# Altium project SAML21_Xplained_Pro.PrjPCB (part 1 of 3)
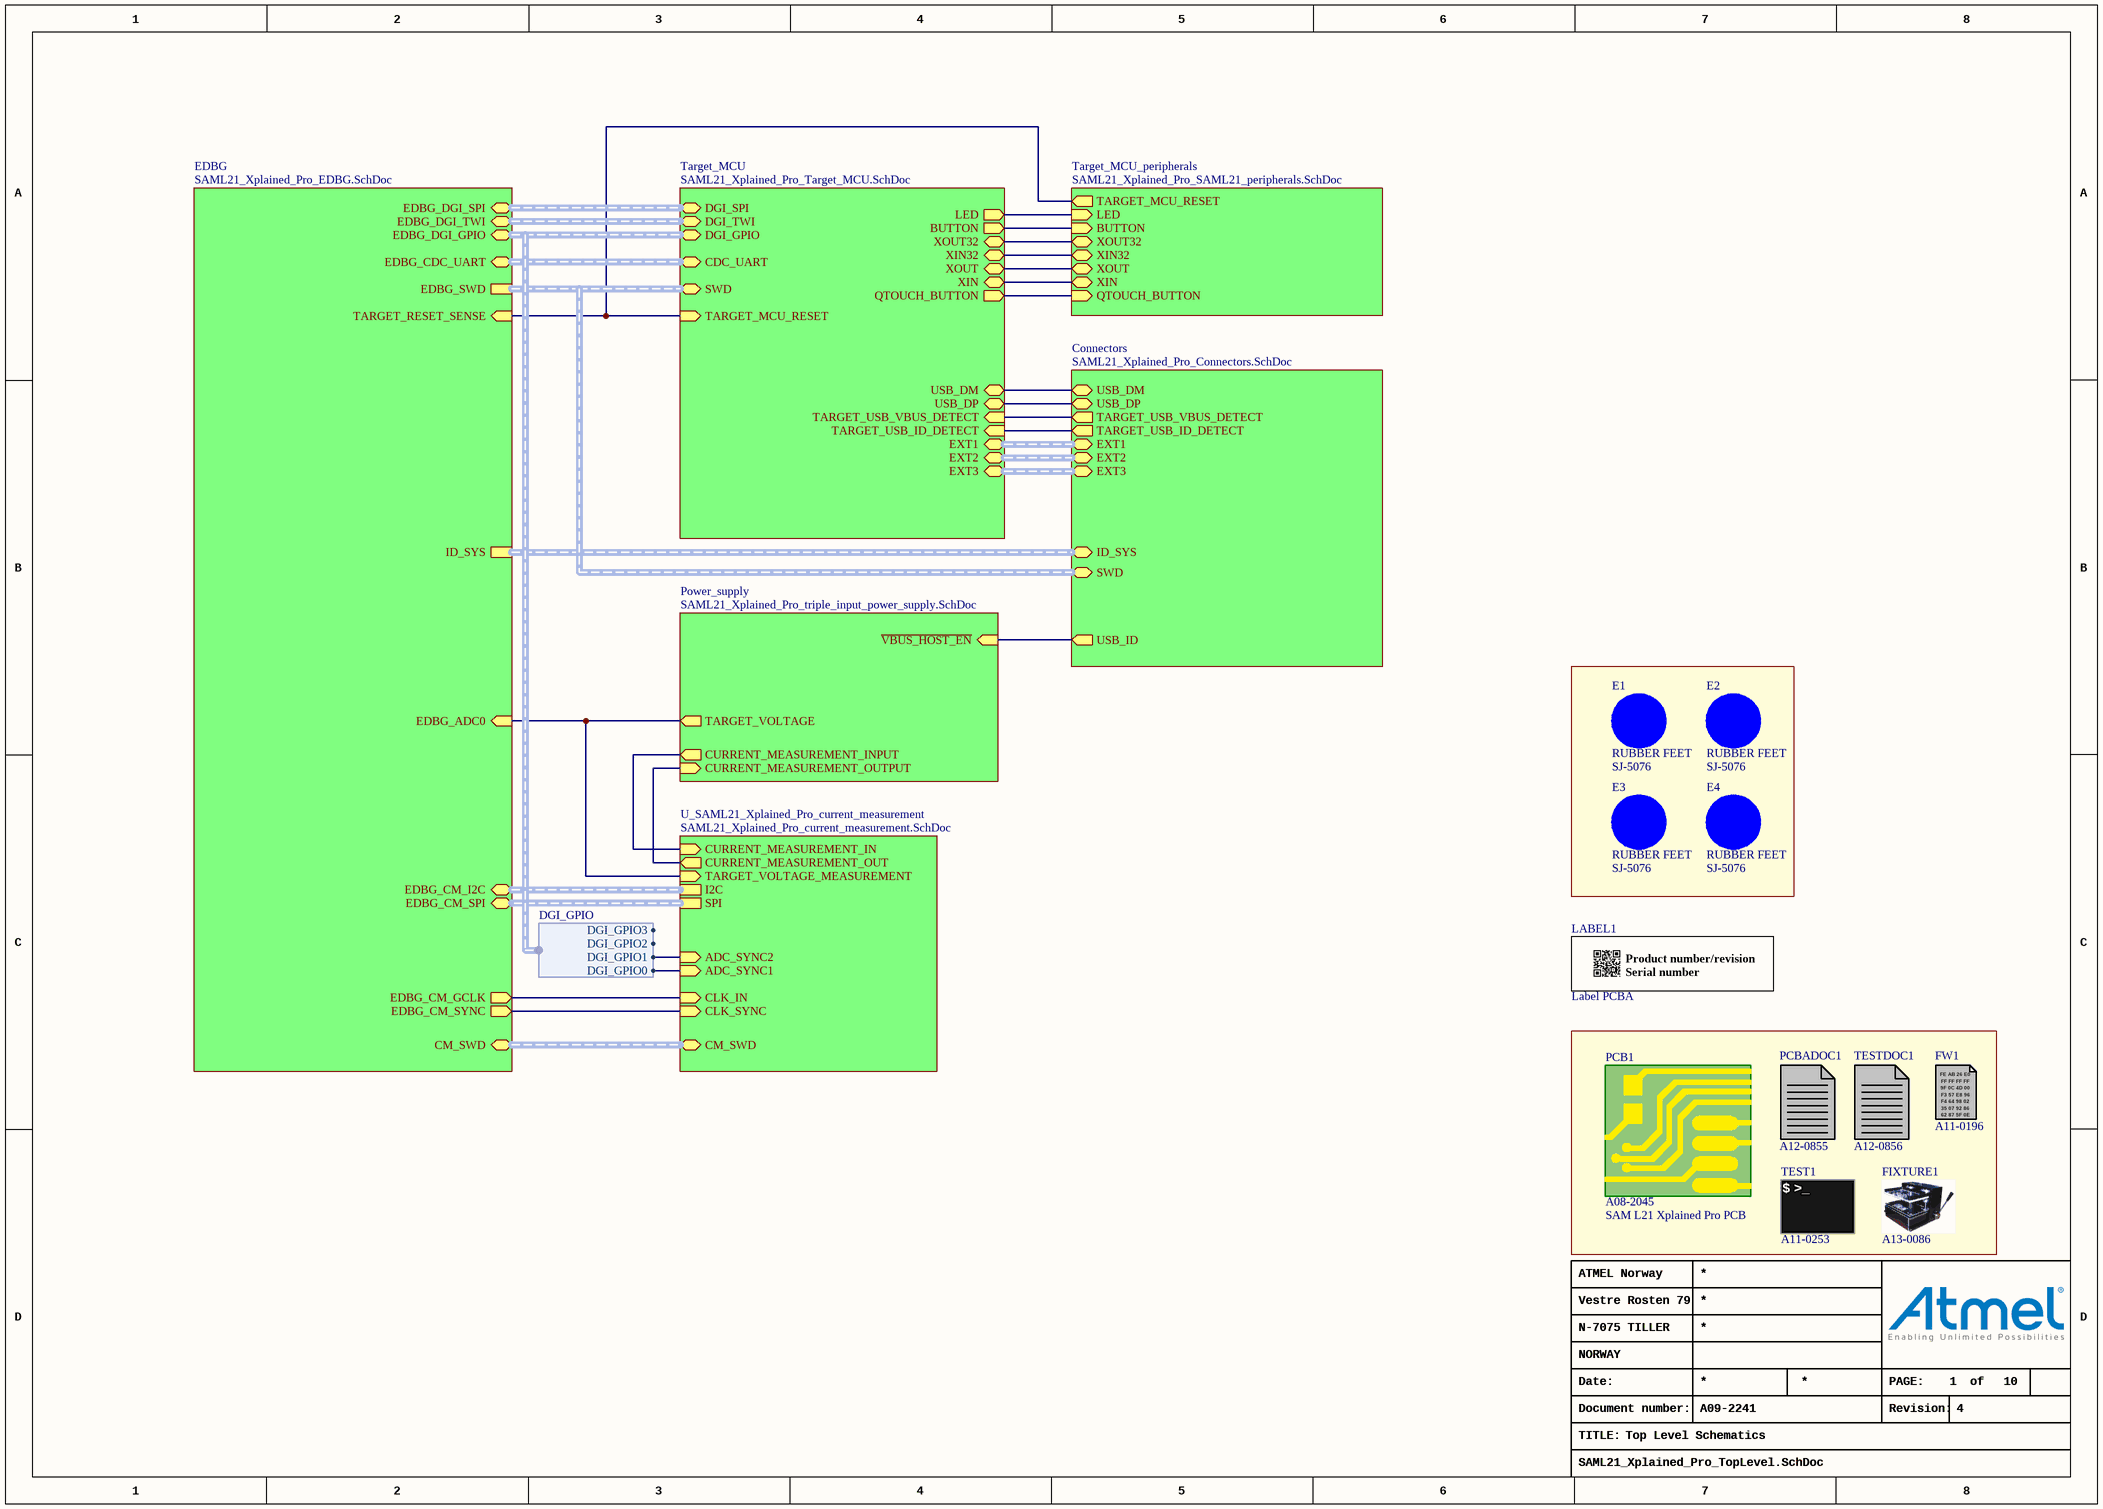
[diagram p0: SAML21_Xplained_Pro_TopLevel.SchDoc]
10 sheets, 207 parts. Net scope: hierarchical (ports join the sheet entries above them; power ports are global).
Board file: SAML21_Xplained_Pro.PcbDoc
Sheets:
  SAML21_Xplained_Pro_TopLevel.SchDoc
    Target_MCU = SAML21_Xplained_Pro_Target_MCU.SchDoc
    EDBG = SAML21_Xplained_Pro_EDBG.SchDoc
    Connectors = SAML21_Xplained_Pro_Connectors.SchDoc
    Power_supply = SAML21_Xplained_Pro_triple_input_power_supply.SchDoc
    U_SAML21_Xplained_Pro_current_measurement = SAML21_Xplained_Pro_current_measurement.SchDoc
      U_SAML21_Xplained_Pro_current_measurement_calibration = SAML21_Xplained_Pro_current_measurement_calibration.SchDoc
      U_SAML21_Xplained_Pro_current_measurement_control = SAML21_Xplained_Pro_current_measurement_control.SchDoc
      U_SAML21_Xplained_Pro_current_measurement_frontend = SAML21_Xplained_Pro_current_measurement_frontend.SchDoc
    Target_MCU_peripherals = SAML21_Xplained_Pro_SAML21_peripherals.SchDoc

## Sheet SAML21_Xplained_Pro_TopLevel.SchDoc: Top Level Schematics
size A3; Organization: ATMEL Norway; Address1: Vestre Rosten 79; Address2: N-7075 TILLER; Address3: NORWAY; DocumentNumber: A09-2241; Revision: 4; SheetNumber: 1; SheetTotal: 10; PageSetup: Record=PageOptions|CenterHorizontal=True|CenterVertical=True|PrintScale=1.01|XCorrection=1.00|YCorrection=1.00|PrintKind=1|BorderSize=5000000|LeftOffset=0|BottomOffset=0|Orientation=2|PaperLength=1000|PaperWidth=1000|Scale=100|PaperSource=7|PrintQuality=-4|MediaType=1|DitherType=10|PaperKind=Letter|PrintScaleMode=1

### Parts
E1  RUBBER FEET  value SJ-5076  [AP8-00192]
E2  RUBBER FEET  value SJ-5076  [AP8-00192]
E3  RUBBER FEET  value SJ-5076  [AP8-00192]
E4  RUBBER FEET  value SJ-5076  [AP8-00192]
FIXTURE1  AN: A13-0086  (hidden comment: JIG)  (mechanical)
FW1  AN: A11-0196  (hidden comment: FW)  (mechanical)
LABEL1  value Label PCBA  [AP8-00317]  (hidden comment: PCBA_LABEL)
PCB1  value SAM L21 Xplained Pro PCB  AN: A08-2045  (hidden comment: PCB)  (mechanical)
PCBADOC1  AN: A12-0855  (hidden comment: PCBADOC)  (mechanical)
TEST1  AN: A11-0253  (hidden comment: TEST)  (mechanical)
TESTDOC1  AN: A12-0856  (hidden comment: TESTDOC)  (mechanical)

### Sub-sheets
Connectors = SAML21_Xplained_Pro_Connectors.SchDoc: ID_SYS (harness ID_SYS), EXT1 (harness EXT), EXT3 (harness EXT), EXT2 (harness EXT), USB_ID (out), USB_DM (bidir), USB_DP (bidir), TARGET_USB_VBUS_DETECT (out), TARGET_USB_ID_DETECT (out), SWD (harness SWD)
EDBG = SAML21_Xplained_Pro_EDBG.SchDoc: ID_SYS (harness ID_SYS), EDBG_SWD (harness SWD), EDBG_CDC_UART (harness CDC_UART), EDBG_DGI_TWI (harness DGI_TWI), EDBG_DGI_SPI (harness DGI_SPI), EDBG_DGI_GPIO (harness DGI_GPIO), TARGET_RESET_SENSE (in), EDBG_ADC0 (in), EDBG_CM_I2C (harness I2C), EDBG_CM_SPI (harness SPI), EDBG_CM_GCLK (out), EDBG_CM_SYNC (out), CM_SWD (harness SWD)
Power_supply = SAML21_Xplained_Pro_triple_input_power_supply.SchDoc: TARGET_VOLTAGE (out), ~{VBUS_HOST_EN} (in), CURRENT_MEASUREMENT_INPUT (out), CURRENT_MEASUREMENT_OUTPUT (in)
Target_MCU = SAML21_Xplained_Pro_Target_MCU.SchDoc: SWD (harness SWD), DGI_SPI (harness DGI_SPI), DGI_TWI (harness DGI_TWI), DGI_GPIO (harness DGI_GPIO), CDC_UART (harness CDC_UART), TARGET_MCU_RESET (in), EXT2 (harness EXT), EXT3 (harness EXT), EXT1 (harness EXT), USB_DM (bidir), USB_DP (bidir), BUTTON (out), LED (out), TARGET_USB_VBUS_DETECT (in), TARGET_USB_ID_DETECT (in), XIN32 (bidir), XOUT32 (bidir), QTOUCH_BUTTON (out), XIN (bidir), XOUT (bidir)
Target_MCU_peripherals = SAML21_Xplained_Pro_SAML21_peripherals.SchDoc: XIN32 (bidir), XOUT32 (bidir), LED (in), QTOUCH_BUTTON (in), BUTTON (in), TARGET_MCU_RESET (out), XIN (bidir), XOUT (bidir)
U_SAML21_Xplained_Pro_current_measurement = SAML21_Xplained_Pro_current_measurement.SchDoc: I2C (harness I2C), SPI (harness SPI), ADC_SYNC1 (in), ADC_SYNC2 (in), CLK_IN (in), CLK_SYNC (in), CURRENT_MEASUREMENT_OUT (out), CURRENT_MEASUREMENT_IN (in), TARGET_VOLTAGE_MEASUREMENT (in), CM_SWD (harness SWD)

### Harnesses
DGI_GPIO: DGI_GPIO0, DGI_GPIO1, DGI_GPIO2, DGI_GPIO3

### Nets
CM_PA09_AIN17: sheet EDBG/EDBG_ADC0, sheet Power_supply/TARGET_VOLTAGE, sheet U_SAML21_Xplained_Pro_current_measurement/TARGET_VOLTAGE_MEASUREMENT
CM_PA11_GCLK5: sheet EDBG/EDBG_CM_SYNC, sheet U_SAML21_Xplained_Pro_current_measurement/CLK_SYNC
CM_PA14_GCLK0: sheet EDBG/EDBG_CM_GCLK, sheet U_SAML21_Xplained_Pro_current_measurement/CLK_IN
PA00_XIN32: sheet Target_MCU/XIN32, sheet Target_MCU_peripherals/XIN32
PA01_XOUT32: sheet Target_MCU/XOUT32, sheet Target_MCU_peripherals/XOUT32
PA02_GPIO_SS_BTN: sheet Target_MCU/BUTTON, sheet Target_MCU_peripherals/BUTTON
PA10_ADC18_PTCY8: sheet Target_MCU/QTOUCH_BUTTON, sheet Target_MCU_peripherals/QTOUCH_BUTTON
PA14: sheet Target_MCU/XIN, sheet Target_MCU_peripherals/XIN
PA14_USB_VBUS: sheet Target_MCU/TARGET_USB_VBUS_DETECT, sheet Connectors/TARGET_USB_VBUS_DETECT
PA15: sheet Target_MCU/XOUT, sheet Target_MCU_peripherals/XOUT
PA16_GPIO_IRQ: sheet U_SAML21_Xplained_Pro_current_measurement/ADC_SYNC2, sheet Target_MCU/DGI_GPIO.DGI_GPIO1
PB01_ADC9: sheet U_SAML21_Xplained_Pro_current_measurement/ADC_SYNC1, sheet Target_MCU/DGI_GPIO.DGI_GPIO0
PB02_USB_ID: sheet Target_MCU/TARGET_USB_ID_DETECT, sheet Connectors/TARGET_USB_ID_DETECT
PB10_PWM_TCC0_4: sheet Target_MCU/LED, sheet Target_MCU_peripherals/LED
TARGET_MCU_RESET: sheet Target_MCU/TARGET_MCU_RESET, sheet EDBG/TARGET_RESET_SENSE, sheet Target_MCU_peripherals/TARGET_MCU_RESET
TARGET_USB_ID: sheet Connectors/USB_ID, sheet Power_supply/~{VBUS_HOST_EN}
TARGET_USB_N: sheet Target_MCU/USB_DM, sheet Connectors/USB_DM
TARGET_USB_P: sheet Target_MCU/USB_DP, sheet Connectors/USB_DP
VCC_P3V3_CM_IN: sheet Power_supply/CURRENT_MEASUREMENT_INPUT, sheet U_SAML21_Xplained_Pro_current_measurement/CURRENT_MEASUREMENT_IN
NetJ101_3: sheet Power_supply/CURRENT_MEASUREMENT_OUTPUT, sheet U_SAML21_Xplained_Pro_current_measurement/CURRENT_MEASUREMENT_OUT

Not connected (* = marked no-connect by the designer): E1 1(FIDUCIAL); E2 1(FIDUCIAL); E3 1(FIDUCIAL); E4 1(FIDUCIAL)

### Buses and harness runs
harness sheet Connectors/EXT1 = sheet Target_MCU/EXT1
harness sheet Connectors/EXT2 = sheet Target_MCU/EXT2
harness sheet Connectors/EXT3 = sheet Target_MCU/EXT3
harness sheet Connectors/ID_SYS = sheet EDBG/ID_SYS
harness sheet Connectors/SWD = sheet EDBG/EDBG_SWD = sheet Target_MCU/SWD
harness sheet EDBG/CM_SWD = sheet U_SAML21_Xplained_Pro_current_measurement/CM_SWD
harness sheet EDBG/EDBG_CDC_UART = sheet Target_MCU/CDC_UART
harness sheet EDBG/EDBG_CM_I2C = sheet U_SAML21_Xplained_Pro_current_measurement/I2C
harness sheet EDBG/EDBG_CM_SPI = sheet U_SAML21_Xplained_Pro_current_measurement/SPI
harness sheet EDBG/EDBG_DGI_GPIO = sheet Target_MCU/DGI_GPIO
harness sheet EDBG/EDBG_DGI_SPI = sheet Target_MCU/DGI_SPI
harness sheet EDBG/EDBG_DGI_TWI = sheet Target_MCU/DGI_TWI

### Notes on the sheet
- Date:
- PAGE:
- of
- TITLE:
- Document number:
- Revision:
- (in symbol A09-0611) / Product number/revision / Serial number
- (in symbol A11-0196) FE AB 26 E0; FF FF FF FF; 9F 0C 4D 00; F3 57 E8 96; F4 64 98 02; 35 07 92 86; 62 87 5F 0E
- (in symbol A11-0253) $ >_

### Library data of the parts
E1-E4 = A08-0053: 2.8mm adhesive feet,diam 8.0mm; PartGroup: Mechanical devices,Mounting accessories; Manufacturer: 3M; AN: A08-0053; Height: 2,79999995231628; MPN: SJ-5076
FIXTURE1 = A13-0086: Xplained PRO MCU board Jupiter Test Fixture; PartGroup: Test Equipment,Test Fixtures; Manufacturer: ESCATEC; Value: Xplained PRO MCU board Jupiter Test Fixture; MPN: Xplained PRO MCU board Jupiter Test Fixture
FW1 = A11-0196: EDBG secured firmware; PartGroup: Software,Firmware,Tools; Manufacturer: ATMEL; Value: EDBG secured firmware
LABEL1 = A09-0611: PCBA identification label PP Top White Gloss; PartGroup: Mechanical devices,Packaging materials,Printed Labels; Manufacturer: ACT Logimark AS; MPN: 505462; AN: A09-0611
PCB1 = A08-2045: SAM L21 Xplained Pro PCB, 4 layer, 60mm x 100mm; PartGroup: Mechanical devices,Printed circuit boards
PCBADOC1 = A12-0855: SAM L21 Xplained Pro PCBA documentation; PartGroup: Documentation,PCBA Documents,Atmel; Value: A09-2241 PCBA Files
TEST1 = A11-0253: Fixture eggTest for SAM L21 Xplained Pro; PartGroup: Software,Test software,Starter Kit; Value: SAM L21 Xplained Pro Test
TESTDOC1 = A12-0856: SAM L21 Xplained Pro Test Instructions; PartGroup: Documentation,Procedures,Test Instructions; Value: SAM L21 Xplained Pro Test Instructions

## Sheet SAML21_Xplained_Pro_Target_MCU.SchDoc: Target MCU
size A3; Organization: ATMEL Norway; Address1: Vestre Rosten 79; Address2: N-7075 TILLER; Address3: NORWAY; DocumentNumber: A09-2241; Revision: 4; SheetNumber: 2; SheetTotal: 10; PageSetup: Record=PageOptions|CenterHorizontal=True|CenterVertical=True|PrintScale=1.01|XCorrection=1.00|YCorrection=1.00|PrintKind=1|BorderSize=5000000|LeftOffset=0|BottomOffset=0|Orientation=2|PaperLength=1000|PaperWidth=1000|Scale=100|PaperSource=7|PrintQuality=-4|MediaType=1|DitherType=10|PaperKind=A3 (297 x 420 mm)|PrintScaleMode=1
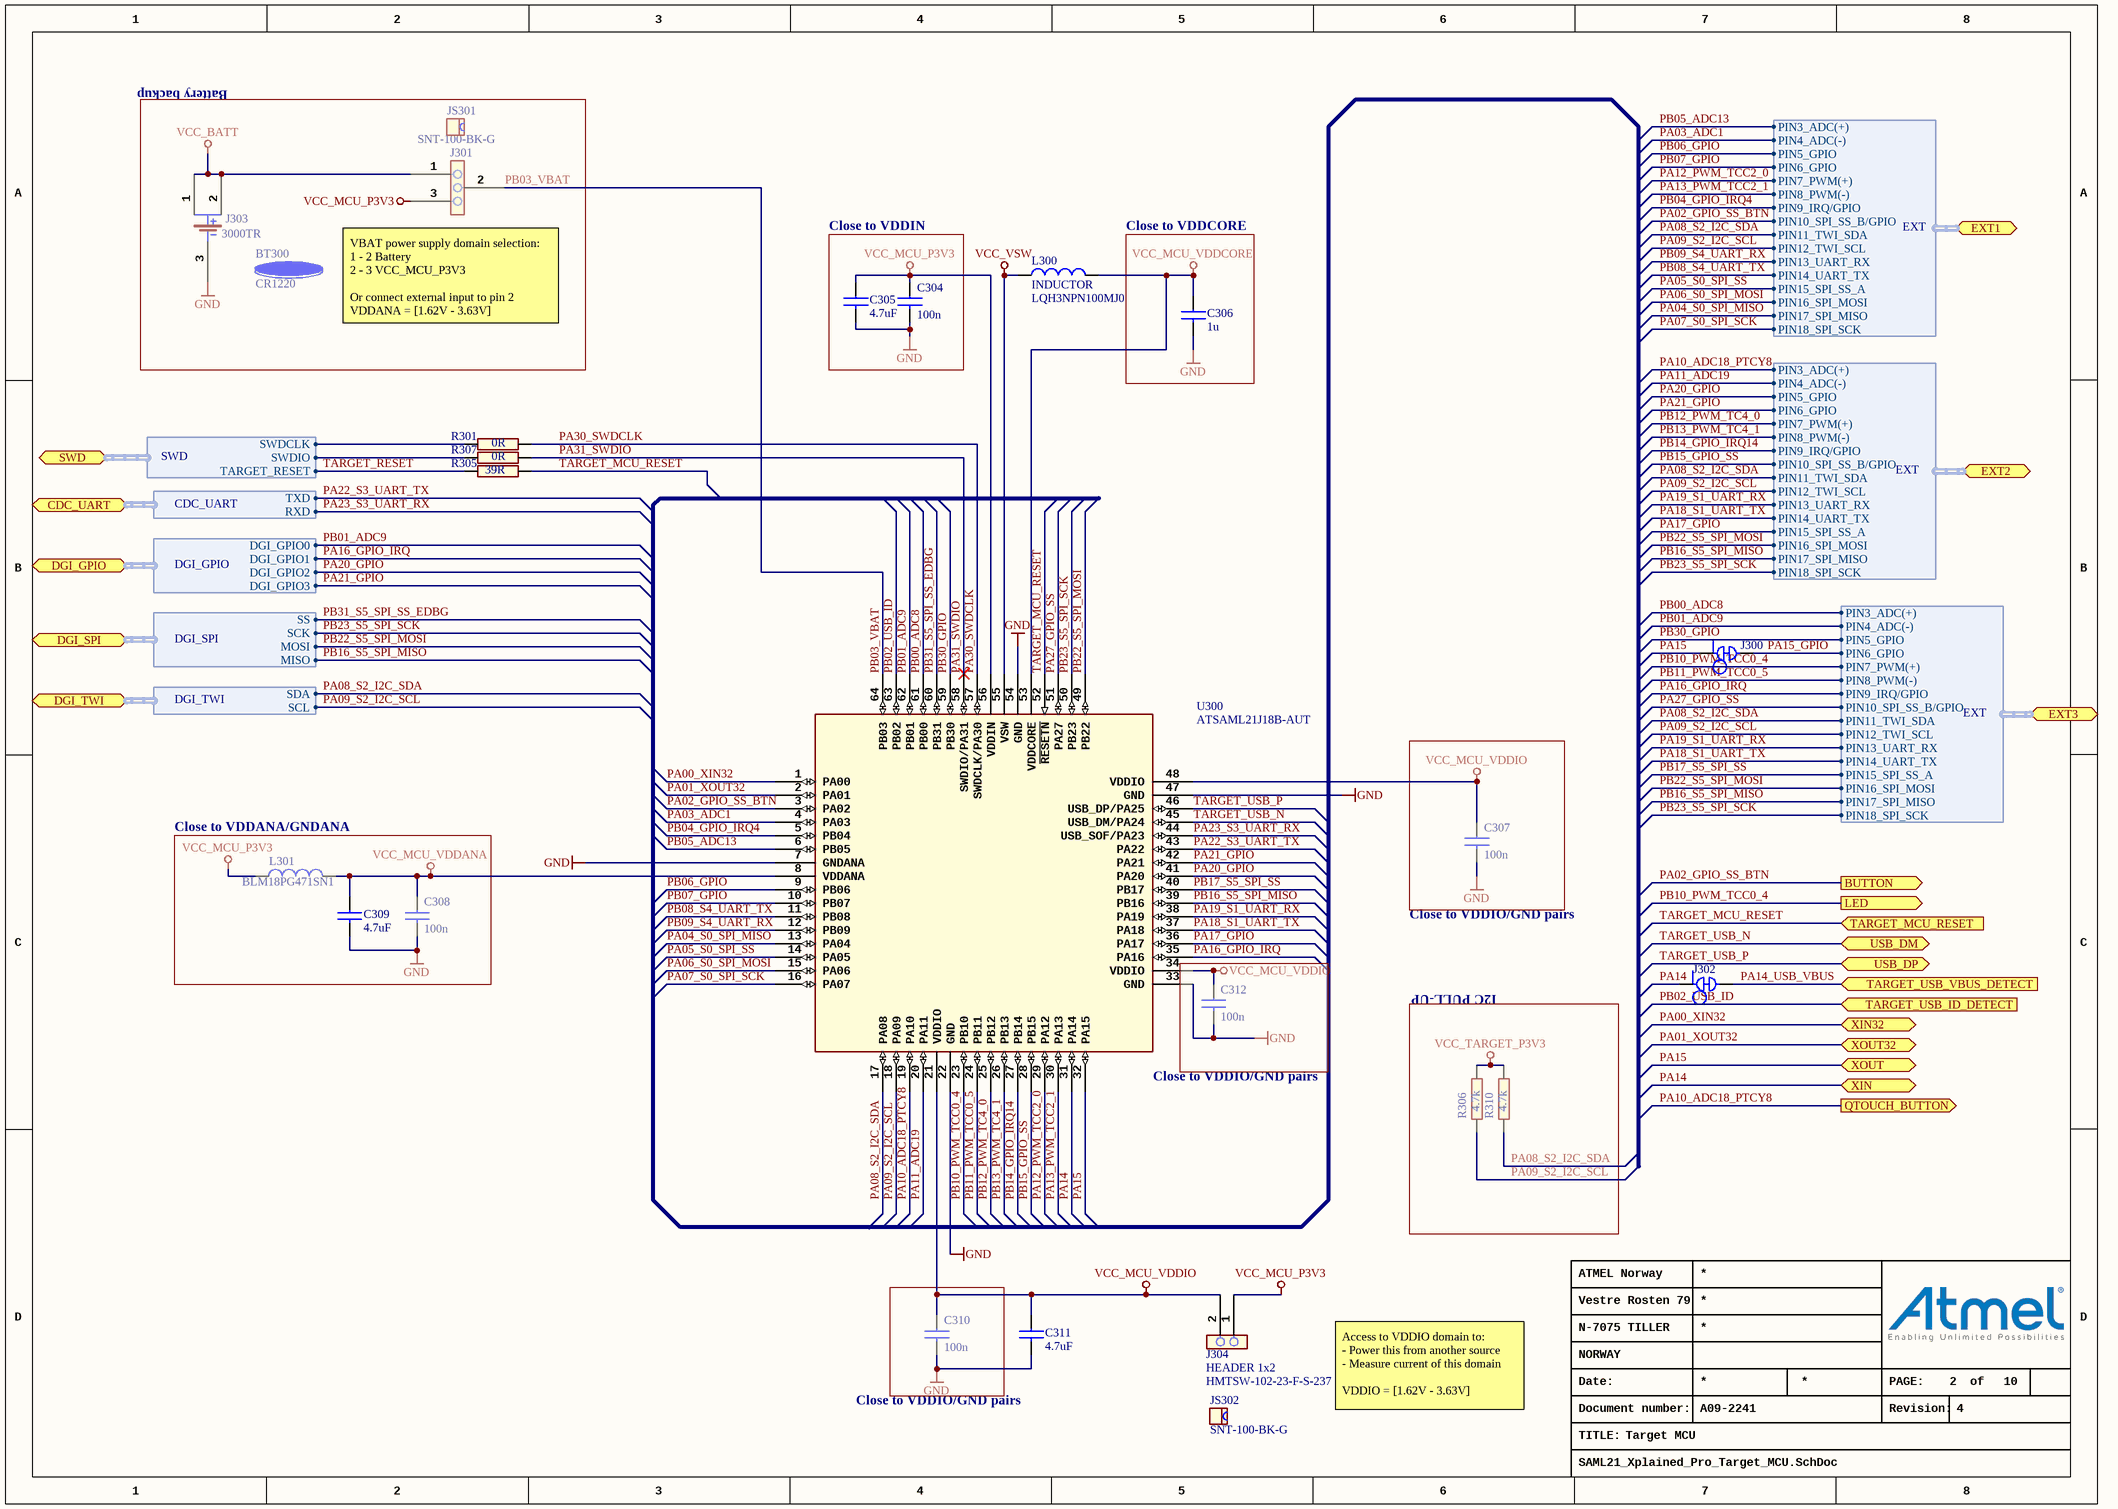
[diagram p1: SAML21_Xplained_Pro_Target_MCU.SchDoc]

### Parts
BT300  value CR1220  [AP9-00125]  (hidden comment: COIN-CELL)
C304  value 100n  [AP1-00053]  (hidden comment: CAP-NONPOL)
C305  value 4.7uF  [AP1-00117]  (hidden comment: CAP-NONPOL)
C306  value 1u  [AP1-00053]  (hidden comment: CAP-NONPOL)
C307  value 100n  [AP1-00053]  (hidden comment: CAP-NONPOL)
C308  value 100n  [AP1-00053]  (hidden comment: CAP-NONPOL)
C309  value 4.7uF  [AP1-00117]  (hidden comment: CAP-NONPOL)
C310  value 100n  [AP1-00053]  (hidden comment: CAP-NONPOL)
C311  value 4.7uF  [AP1-00117]  (hidden comment: CAP-NONPOL)
C312  value 100n  [AP1-00053]  (hidden comment: CAP-NONPOL)
J300  (no value)  [AP9-00044]  (net tie, no BOM)
J301  Same as A08-1614 but with 1mm hole for optimal reflow soldering (no misalignment of the component)  [AP8-00745]  (value not drawn)
J302  (no value)  [AP9-00044]  (net tie, no BOM)
J303  value 3000TR  [AP8-00313]  (hidden comment: Elfa no: 69-525-01)
J304  HEADER 1x2  value HMTSW-102-23-F-S-237  [AP8-00733]
JS301  value SNT-100-BK-G  [AP8-00525]
JS302  value SNT-100-BK-G  [AP8-00525]
L300  INDUCTOR  value LQH3NPN100MJ0  [AP3-00115]
L301  BLM18PG471SN1  [AP3-00005]
R301  value 0R  [AP2-00011]  (hidden comment: R2)
R305  value 39R  [AP2-00011]  (hidden comment: R2)
R306  value 4.7k  [AP2-00011]  (hidden comment: R2)
R307  value 0R  [AP2-00011]  (hidden comment: R2)
R310  value 4.7k  [AP2-00011]  (hidden comment: R2)
U300  value ATSAML21J18B-AUT  [AP6-00173]  (hidden comment: TQFP64)

### Blocks framed on the sheet
Battery backup: BT300 J301 J303 JS301
Close to VDDIN: C304 C305
Close to VDDCORE: C306
Close to VDDANA/GNDANA: C308 C309 L301
I2C PULL-UP: R306 R310

### Ports
BUTTON (out), CDC_UART (harness CDC_UART), DGI_GPIO (harness DGI_GPIO), DGI_SPI (harness DGI_SPI), DGI_TWI (harness DGI_TWI), EXT1 (harness EXT), EXT2 (harness EXT), EXT3 (harness EXT), LED (out), QTOUCH_BUTTON (out), SWD (harness SWD), TARGET_MCU_RESET (in), TARGET_USB_ID_DETECT (in), TARGET_USB_VBUS_DETECT (in), USB_DM (bidir), USB_DP (bidir), XIN32 (bidir), XIN (bidir), XOUT32 (bidir), XOUT (bidir)

### Harnesses
SWD: SWDCLK, SWDIO, TARGET_RESET
DGI_GPIO: DGI_GPIO0, DGI_GPIO1, DGI_GPIO2, DGI_GPIO3
DGI_SPI: MISO, MOSI, SCK, SS
DGI_TWI: SCL, SDA
CDC_UART: RXD, TXD
EXT: PIN10_SPI_SS_B/GPIO, PIN11_TWI_SDA, PIN12_TWI_SCL, PIN13_UART_RX, PIN14_UART_TX, PIN15_SPI_SS_A, PIN16_SPI_MOSI, PIN17_SPI_MISO, PIN18_SPI_SCK, PIN3_ADC(+), PIN4_ADC(-), PIN5_GPIO, PIN6_GPIO, PIN7_PWM(+), PIN8_PWM(-), PIN9_IRQ/GPIO

### Nets
GND: C304.2 C305.2 C306.2 C307.2 C308.2 C309.2 C310.2 C311.2 C312.2 J303.3 U300.7(GNDANA) U300.22(GND) U300.33(GND) U300.47(GND) U300.54(GND)
VCC_BATT: J301.1 J303.1 J303.2
VCC_MCU_P3V3: C304.1 C305.1 J301.3 J304.1 L301.1 U300.56(VDDIN)
VCC_MCU_VDDANA: C308.1 C309.1 L301.2 U300.8(VDDANA)
VCC_MCU_VDDCORE: C306.1 L300.2 U300.53(VDDCORE)
VCC_MCU_VDDIO: C307.1 C310.1 C311.1 C312.1 J304.2 U300.21(VDDIO) U300.34(VDDIO) U300.48(VDDIO)
VCC_TARGET_P3V3: R306.2 R310.2
VCC_VSW: L300.1 U300.55(VSW)
PA00_XIN32: U300.1(PA00) ; port XIN32
PA01_XOUT32: U300.2(PA01) ; port XOUT32
PA02_GPIO_SS_BTN: U300.3(PA02) ; port BUTTON, port EXT1.PIN10_SPI_SS_B/GPIO
PA03_ADC1: U300.4(PA03) ; port EXT1.PIN4_ADC(-)
PA04_S0_SPI_MISO: U300.13(PA04) ; port EXT1.PIN17_SPI_MISO
PA05_S0_SPI_SS: U300.14(PA05) ; port EXT1.PIN15_SPI_SS_A
PA06_S0_SPI_MOSI: U300.15(PA06) ; port EXT1.PIN16_SPI_MOSI
PA07_S0_SPI_SCK: U300.16(PA07) ; port EXT1.PIN18_SPI_SCK
PA08_S2_I2C_SDA: R310.1 U300.17(PA08) ; port DGI_TWI.SDA, port EXT1.PIN11_TWI_SDA, port EXT2.PIN11_TWI_SDA, port EXT3.PIN11_TWI_SDA  [project net EDBG_DGI_SDA]
PA09_S2_I2C_SCL: R306.1 U300.18(PA09) ; port DGI_TWI.SCL, port EXT1.PIN12_TWI_SCL, port EXT2.PIN12_TWI_SCL, port EXT3.PIN12_TWI_SCL  [project net EDBG_DGI_SCL]
PA10_ADC18_PTCY8: U300.19(PA10) ; port QTOUCH_BUTTON, port EXT2.PIN3_ADC(+)
PA11_ADC19: U300.20(PA11) ; port EXT2.PIN4_ADC(-)
PA12_PWM_TCC2_0: U300.29(PA12) ; port EXT1.PIN7_PWM(+)
PA13_PWM_TCC2_1: U300.30(PA13) ; port EXT1.PIN8_PWM(-)
PA14: J302.1 U300.31(PA14) ; port XIN
PA14_USB_VBUS: J302.2 ; port TARGET_USB_VBUS_DETECT
PA15: J300.1 U300.32(PA15) ; port XOUT
PA15_GPIO: J300.2 ; port EXT3.PIN6_GPIO
PA16_GPIO_IRQ: U300.35(PA16) ; port DGI_GPIO.DGI_GPIO1, port EXT3.PIN9_IRQ/GPIO
PA17_GPIO: U300.36(PA17) ; port EXT2.PIN15_SPI_SS_A
PA18_S1_UART_TX: U300.37(PA18) ; port EXT2.PIN14_UART_TX, port EXT3.PIN14_UART_TX
PA19_S1_UART_RX: U300.38(PA19) ; port EXT2.PIN13_UART_RX, port EXT3.PIN13_UART_RX
PA20_GPIO: U300.41(PA20) ; port DGI_GPIO.DGI_GPIO2, port EXT2.PIN5_GPIO
PA21_GPIO: U300.42(PA21) ; port DGI_GPIO.DGI_GPIO3, port EXT2.PIN6_GPIO
PA22_S3_UART_TX: U300.43(PA22) ; port CDC_UART.TXD  [project net EDBG_CDC_USART_RX]
PA23_S3_UART_RX: U300.44(USB_SOF/PA23) ; port CDC_UART.RXD
PA27_GPIO_SS: U300.51(PA27) ; port EXT3.PIN10_SPI_SS_B/GPIO
PA30_SWDCLK: R301.1 U300.57(SWDCLK/PA30)
PA31_SWDIO: R307.1 U300.58(SWDIO/PA31)
PB00_ADC8: U300.61(PB00) ; port EXT3.PIN3_ADC(+)
PB01_ADC9: U300.62(PB01) ; port DGI_GPIO.DGI_GPIO0, port EXT3.PIN4_ADC(-)
PB02_USB_ID: U300.63(PB02) ; port TARGET_USB_ID_DETECT
PB03_VBAT: J301.2 U300.64(PB03)
PB04_GPIO_IRQ4: U300.5(PB04) ; port EXT1.PIN9_IRQ/GPIO
PB05_ADC13: U300.6(PB05) ; port EXT1.PIN3_ADC(+)
PB06_GPIO: U300.9(PB06) ; port EXT1.PIN5_GPIO
PB07_GPIO: U300.10(PB07) ; port EXT1.PIN6_GPIO
PB08_S4_UART_TX: U300.11(PB08) ; port EXT1.PIN14_UART_TX
PB09_S4_UART_RX: U300.12(PB09) ; port EXT1.PIN13_UART_RX
PB10_PWM_TCC0_4: U300.23(PB10) ; port LED, port EXT3.PIN7_PWM(+)
PB11_PWM_TCC0_5: U300.24(PB11) ; port EXT3.PIN8_PWM(-)
PB12_PWM_TC4_0: U300.25(PB12) ; port EXT2.PIN7_PWM(+)
PB13_PWM_TC4_1: U300.26(PB13) ; port EXT2.PIN8_PWM(-)
PB14_GPIO_IRQ14: U300.27(PB14) ; port EXT2.PIN9_IRQ/GPIO
PB15_GPIO_SS: U300.28(PB15) ; port EXT2.PIN10_SPI_SS_B/GPIO
PB16_S5_SPI_MISO: U300.39(PB16) ; port DGI_SPI.MISO, port EXT2.PIN17_SPI_MISO, port EXT3.PIN17_SPI_MISO
PB17_S5_SPI_SS: U300.40(PB17) ; port EXT3.PIN15_SPI_SS_A
PB22_S5_SPI_MOSI: U300.49(PB22) ; port DGI_SPI.MOSI, port EXT2.PIN16_SPI_MOSI, port EXT3.PIN16_SPI_MOSI  [project net EDBG_SPI_DGI_MOSI]
PB23_S5_SPI_SCK: U300.50(PB23) ; port DGI_SPI.SCK, port EXT2.PIN18_SPI_SCK, port EXT3.PIN18_SPI_SCK  [project net EDBG_SPI_DGI_SCK]
PB30_GPIO: U300.59(PB30) ; port EXT3.PIN5_GPIO
PB31_S5_SPI_SS_EDBG: U300.60(PB31) ; port DGI_SPI.SS  [project net EDBG_SPI_DGI_SS]
SWDCLK: R301.2 ; port SWD.SWDCLK
SWDIO: R307.2 ; port SWD.SWDIO
TARGET_MCU_RESET: R305.2 U300.52(~{RESETN}) ; port TARGET_MCU_RESET
TARGET_RESET: R305.1 ; port SWD.TARGET_RESET
TARGET_USB_N: U300.45(USB_DM/PA24) ; port USB_DM
TARGET_USB_P: U300.46(USB_DP/PA25) ; port USB_DP

### Notes on the sheet
- (near J301) VBAT power supply domain selection:
  1 - 2 Battery
  2 - 3 VCC_MCU_P3V3
  Or connect external input to pin 2
  VDDANA = [1.62V - 3.63V]
- Close to VDDIO/GND pairs
- (near U300) Close to VDDIO/GND pairs
- Access to VDDIO domain to:
  - Power this from another source
  - Measure current of this domain
  VDDIO = [1.62V - 3.63V]
- Date:
- PAGE:
- of
- TITLE:
- Document number:
- Revision:

### Library data of the parts
BT300 = A09-0619: CR1220 Lithium coin-cell battery; PartGroup: Other Devices,Power Products,Batteries; Manufacturer: Panasonic; AN: A09-0619; MPN: CR1220; Height: 2
C304 C307 C308 C310 C312 = A01-0246: Ceramic capacitor, SMD 0402, X7R, 16V, +/-10%; PartGroup: Capacitors,Ceramic,SMD 0402; Manufacturer: Kemet; MPN: C0402C104K4RACTU; TemperatureRange: -55 - +125 deg C; AN: A01-0246; Tolerance: 16V, +/-10%; Height: 0,5
C305 C309 C311 = A01-0377: Ceramic capacitor, SMD 0603, X5R, 10V, 10% (de31036); PartGroup: Capacitors,Ceramic,SMD 0603; Manufacturer: tdk; MPN: C1608X5R1A475K; TemperatureRange: -55 - +85 deg C; AN: A01-0377; Tolerance: 10%; Height: 0.800000011920929
C306 = A01-0286: Ceramic capacitor, SMD 0402, X5R, 6.3V, +/-10% (de26942); PartGroup: Capacitors,Ceramic,SMD 0402; Manufacturer: Kemet; MPN: C0402C105K9PAC; TemperatureRange: -55 to 85 deg C; AN: A01-0286; Tolerance: +/-10%; Height: 0,5
J300 J302 = A09-0783: Default closed SMD strap, 0603 size; PartGroup: Mechanical devices,PCB implemented components; Value: SMD-STRAP_0603_CLOSED; AN: A09-0783; Height: 0
J301 = A08-1799: 1x3 pin header, 2.54mm pitch, Pin-in-Paste THM, 1mm hole; PartGroup: Mechanical devices,Connectors,Pin headers; Manufacturer: SAMTEC; Value: HMTSW-103-23-F-S-237; AN: A08-1799; Height: 6,09999990463257; MPN: HMTSW-103-23-F-S-237
J303 = A08-0554: CR1220 Li-Ion coin-cell battery clip, SMD; PartGroup: Mechanical devices,Connectors,Power; Manufacturer: Keystone Corp.; AN: A08-0554; Height: 3,1800000667572; MPN: 3000TR
J304 = A08-1754: 1x2 pin header, 2.54mm pitch, Pin-in-Paste THM; PartGroup: Mechanical devices,Connectors,Pin headers; Manufacturer: SAMTEC; TemperatureRange: - 55 deg C to + 125 deg C; AN: A08-1754; Height: 6.09999990463257; MPN: HMTSW-102-23-F-S-237
JS301 JS302 = A08-0543: Jumper cap for 2.54mm pinheader; PartGroup: Mechanical devices,Mounting accessories,Other; Manufacturer: SAMTEC; AN: A08-0543; MPN: SNT-100-BK-G
L300 = A03-0191: 10uH power inductor, Isat = 560mA , Itemp = 710mA, Rdc = 0.360ohm; PartGroup: Inductors,Power Inductors; Manufacturer: Murata; Tolerance: Â±20%; TemperatureRange: -40 - 85Â°C; AN: A03-0191; MPN: LQH3NPN100MJ0; Height: 1.10000002384186
L301 = A03-0035: SMD RF inductor 0603. Z=470Ohm (@100MHz), Max R(dc)=0.65Ohm, Max current=1A; PartGroup: Inductors,EMI; Manufacturer: Murata; Tolerance: ±25%; TemperatureRange: -55°C to +125°C; AN: A03-0035; Value: BLM18PG471SN1; Height: 0,800000011920929; MPN: BLM18PG471SN1
R301 R307 = A02-0163: RES 0.0 OHM 1/16W 0402 SMD; PartGroup: Resistors,SMD,0402 1%; Manufacturer: (n/a); MPN: RMCF0402ZT0R00; Tolerance: 1 %; TemperatureRange: -55 - +125 deg C; AN: A02-0163; Height: 0.349999994039536
R305 = A02-0178: Thick film resistor, SMD 0402, 1/16W, 1%; PartGroup: Resistors,SMD,0402 1%; TemperatureRange: -55 - +125 deg C; AN: A02-0178; Tolerance: 1 %; Height: 0,349999994039536
R306 R310 = A02-0228: Thick film resistor, SMD 0402, 1/16W, 1%; PartGroup: Resistors,SMD,0402 1%; TemperatureRange: -55 - +125 deg C; AN: A02-0228; Tolerance: 1 %; Height: 0.349999994039536
U300 = A06-1311: Atmel 32-bit RISC MCU 64pin; PartGroup: Integrated Circuits,MCU, MPU, DSP,ARM MCU; TemperatureRange: -40Â°C to +85Â°C; ComponentStatus: 'New (not verified)'; Design comment: *; AN: A06-1311; Height: 1,20000004768372; FootprintStatus: 'Active (Verified)'

## Sheet SAML21_Xplained_Pro_EDBG.SchDoc: Embedded Debugger (EDBG)
size A3; Organization: ATMEL Norway; Address1: Vestre Rosten 79; Address2: N-7075 TILLER; Address3: NORWAY; DocumentNumber: A09-2241; Revision: 4; SheetNumber: 10; SheetTotal: 10; PageSetup: Record=PageOptions|CenterHorizontal=True|CenterVertical=True|PrintScale=0.73|XCorrection=1.00|YCorrection=1.00|PrintKind=1|BorderSize=5000000|LeftOffset=0|BottomOffset=0|Orientation=2|PaperLength=1000|PaperWidth=1000|Scale=100|PaperSource=7|PrintQuality=-4|MediaType=1|DitherType=10|PaperKind=A3 (297 x 420 mm)|PrintScaleMode=1
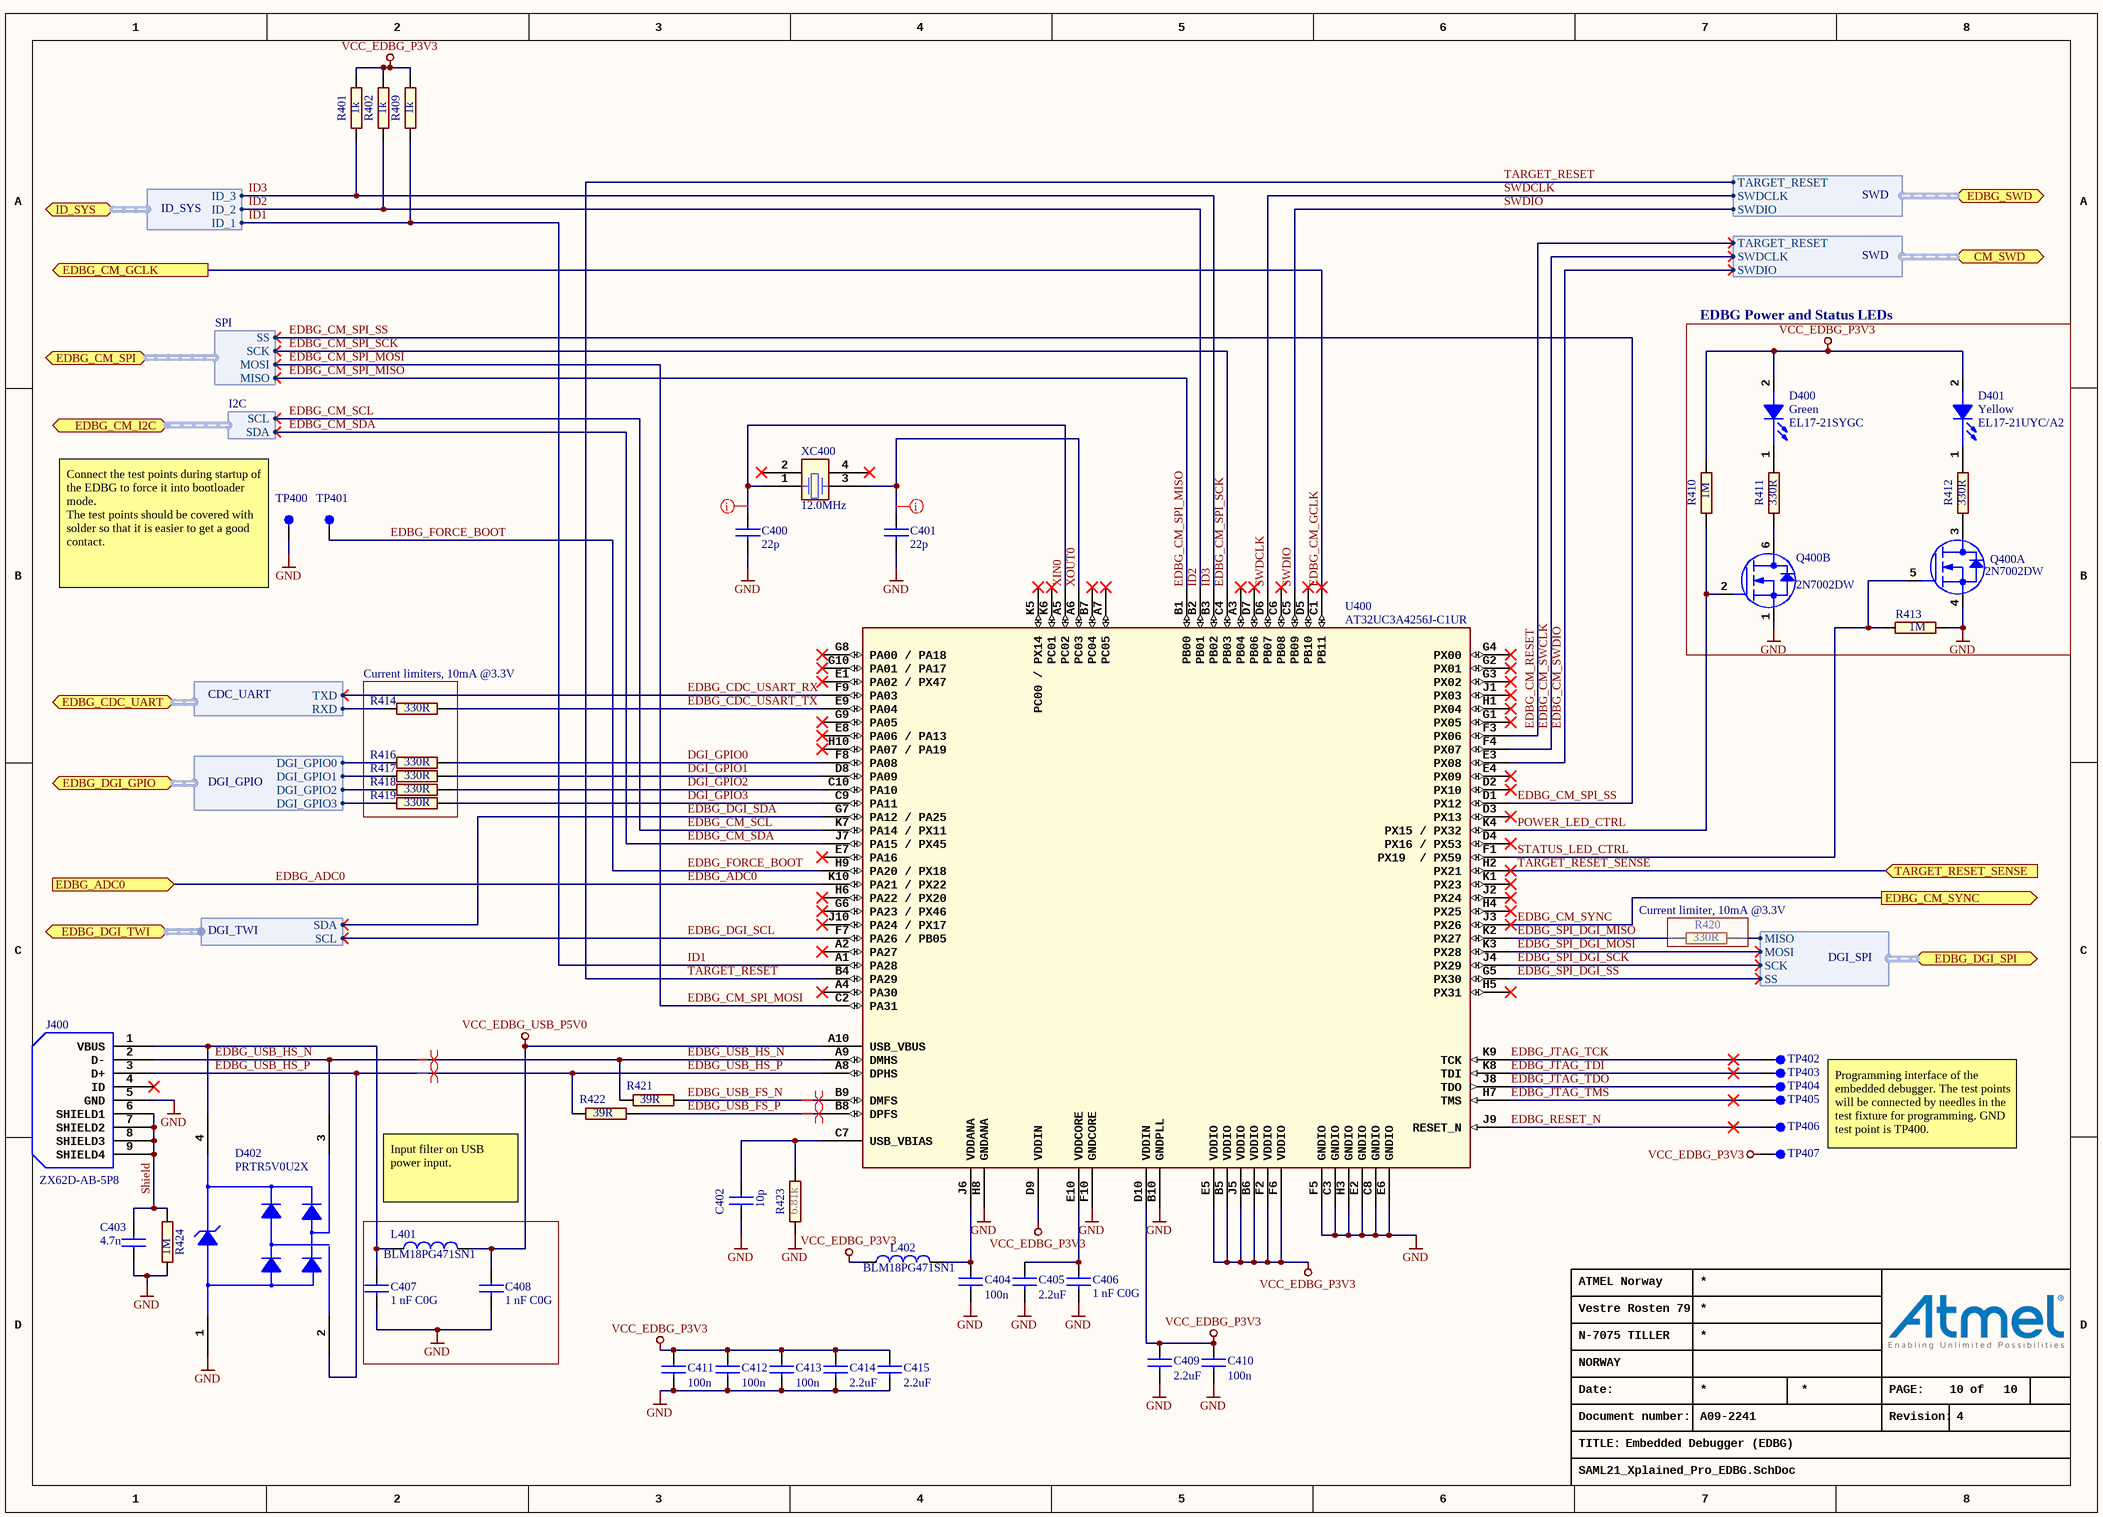
[diagram p2: SAML21_Xplained_Pro_EDBG.SchDoc]

### Parts
C400  22p  [AP1-00053]
C401  22p  [AP1-00053]
C402  10p  [AP1-00053]
C403  value 4.7n  [AP1-00053]  (hidden comment: CAP-NONPOL)
C404  100n  [AP1-00053]
C405  value 2.2uF  [AP1-00053]  (hidden comment: Farnell no: 1288200)
C406  1 nF C0G  [AP1-00053]
C407  1 nF C0G  [AP1-00053]
C408  1 nF C0G  [AP1-00053]
C409  value 2.2uF  [AP1-00053]  (hidden comment: Farnell no: 1288200)
C410  100n  [AP1-00053]
C411  100n  [AP1-00053]
C412  100n  [AP1-00053]
C413  100n  [AP1-00053]
C414  value 2.2uF  [AP1-00053]  (hidden comment: Farnell no: 1288200)
C415  value 2.2uF  [AP1-00053]  (hidden comment: Farnell no: 1288200)
D400  Green  value EL17-21SYGC  [AP4-00013]
D401  Yellow  value EL17-21UYC/A2  [AP4-00013]
D402  PRTR5V0U2X  [AP4-00001]
J400  value ZX62D-AB-5P8  [AP8-00852]  (hidden comment: 2,000 pieces per reel)
L401  BLM18PG471SN1  [AP3-00005]
L402  BLM18PG471SN1  [AP3-00005]
Q400  value 2N7002DW  [AP5-00001]  (hidden comment: Same as 2N7002 but with two MOSFETs in one package)  (parts A,B of 2)
R401  value 1k  [AP2-00000]  (hidden comment: R2)
R402  value 1k  [AP2-00000]  (hidden comment: R2)
R409  value 1k  [AP2-00000]  (hidden comment: R2)
R410  value 1M  [AP2-00011]  (hidden comment: R2)
R411  value 330R  [AP2-00011]  (hidden comment: R2)
R412  value 330R  [AP2-00011]  (hidden comment: R2)
R413  value 1M  [AP2-00011]  (hidden comment: R2)
R414  value 330R  [AP2-00000]  (hidden comment: R2)
R416  value 330R  [AP2-00000]  (hidden comment: R2)
R417  value 330R  [AP2-00000]  (hidden comment: R2)
R418  value 330R  [AP2-00000]  (hidden comment: R2)
R419  value 330R  [AP2-00000]  (hidden comment: R2)
R420  value 330R  [AP2-00000]  (hidden comment: R2)
R421  value 39R  [AP2-00011]  (hidden comment: R2)
R422  value 39R  [AP2-00011]  (hidden comment: R2)
R423  value 6.81k  [AP2-00011]  (hidden comment: R2)
R424  value 1M  [AP2-00011]  (hidden comment: R2)
TP400  TESTPAD  [AP8-00010]  (value not drawn)  (no BOM)
TP401  TESTPAD  [AP8-00010]  (value not drawn)  (no BOM)
TP402  TESTPAD  [AP8-00010]  (value not drawn)  (no BOM)
TP403  TESTPAD  [AP8-00010]  (value not drawn)  (no BOM)
TP404  TESTPAD  [AP8-00010]  (value not drawn)  (no BOM)
TP405  TESTPAD  [AP8-00010]  (value not drawn)  (no BOM)
TP406  TESTPAD  [AP8-00010]  (value not drawn)  (no BOM)
TP407  TESTPAD  [AP8-00010]  (value not drawn)  (no BOM)
U400  value AT32UC3A4256J-C1UR  [AP6-00206]  (hidden comment: 100 ball VFBGA)
XC400  12.0MHz  [AP7-00039]

### Blocks framed on the sheet
EDBG Power and Status LEDs: D400 D401 Q400 R410-R413
Current limiters, 10mA @3.3V: R414 R416-R419

### Ports
CM_SWD (harness SWD), EDBG_ADC0 (in), EDBG_CDC_UART (harness CDC_UART), EDBG_CM_GCLK (out), EDBG_CM_I2C (harness I2C), EDBG_CM_SPI (harness SPI), EDBG_CM_SYNC (out), EDBG_DGI_GPIO (harness DGI_GPIO), EDBG_DGI_SPI (harness DGI_SPI), EDBG_DGI_TWI (harness DGI_TWI), EDBG_SWD (harness SWD), ID_SYS (harness ID_SYS), TARGET_RESET_SENSE (in)

### Harnesses
CDC_UART: TXD, RXD
DGI_SPI: MISO, MOSI, SCK, SS
DGI_GPIO: DGI_GPIO0, DGI_GPIO1, DGI_GPIO2, DGI_GPIO3
ID_SYS: ID_1, ID_2, ID_3
SWD: SWDCLK, SWDIO, TARGET_RESET
DGI_TWI: SCL, SDA
I2C: SCL, SDA
SPI: MISO, MOSI, SCK, SS

### Nets
GND: C400.2 C401.2 C402.2 C403.1 C404.2 C405.2 C406.2 C407.2 C408.2 C409.2 C410.2 C411.2 C412.2 C413.2 C414.2 C415.2 D402.1(GND) J400.5(GND) Q400.1(S2) Q400.4(S1) R413.1 R423.1 R424.1 TP400.1 U400.B10(GNDPLL) U400.C3(GNDIO) U400.C8(GNDIO) U400.E2(GNDIO) U400.E6(GNDIO) U400.F5(GNDIO) U400.F10(GNDCORE) U400.H3(GNDIO) U400.H8(GNDANA)
VCC_EDBG_P3V3: C409.1 C410.1 C411.1 C412.1 C413.1 C414.1 C415.1 D400.2(ANODE) D401.2(ANODE) L402.1 R401.2 R402.2 R409.2 R410.2 TP407.1 U400.B5(VDDIO) U400.B6(VDDIO) U400.D9(VDDIN) U400.D10(VDDIN) U400.E5(VDDIO) U400.F2(VDDIO) U400.F6(VDDIO) U400.J5(VDDIO)  [project net VCC_CM_P3V3]
VCC_EDBG_USB_P5V0: C408.1 L401.2 U400.A10(USB_VBUS)
DGI_GPIO0: R416.2 U400.F8(PA08)
DGI_GPIO1: R417.2 U400.D8(PA09)
DGI_GPIO2: R418.2 U400.C10(PA10)
DGI_GPIO3: R419.2 U400.C9(PA11)
EDBG_ADC0: U400.K10(PA21_/_PX22) ; port EDBG_ADC0  [project net CM_PA09_AIN17]
EDBG_CDC_USART_RX: U400.F9(PA03) ; port EDBG_CDC_UART.TXD
EDBG_CDC_USART_TX: R414.2 U400.E9(PA04)
EDBG_CM_GCLK: U400.C1(PB11) ; port EDBG_CM_GCLK  [project net CM_PA14_GCLK0]
EDBG_CM_RESET: U400.F3(PX06) ; port CM_SWD.TARGET_RESET  [project net CM_RESET_N]
EDBG_CM_SCL: U400.K7(PA14_/_PX11) ; port EDBG_CM_I2C.SCL  [project net CM_PA17_SERCOM1_SCL]
EDBG_CM_SDA: U400.J7(PA15_/_PX45) ; port EDBG_CM_I2C.SDA  [project net CM_PA16_SERCOM1_SDA]
EDBG_CM_SPI_MISO: U400.B1(PB00) ; port EDBG_CM_SPI.MISO  [project net CM_PA24_SERCOM3_PAD2_SPI_MISO]
EDBG_CM_SPI_MOSI: U400.C2(PA31) ; port EDBG_CM_SPI.MOSI  [project net CM_PA22_SERCOM3_PAD0_SPI_MOSI]
EDBG_CM_SPI_SCK: U400.C4(PB03) ; port EDBG_CM_SPI.SCK  [project net CM_PA23_SERCOM3_PAD1_SPI_SCK]
EDBG_CM_SPI_SS: U400.D1(PX12) ; port EDBG_CM_SPI.SS  [project net CM_PA25_SPI_SS]
EDBG_CM_SWCLK: U400.F4(PX07) ; port CM_SWD.SWDCLK  [project net CM_PA30_SWCLK]
EDBG_CM_SWDIO: U400.E3(PX08) ; port CM_SWD.SWDIO  [project net CM_PA31_SWDIO]
EDBG_CM_SYNC: U400.J3(PX26) ; port EDBG_CM_SYNC  [project net CM_PA11_GCLK5]
EDBG_DGI_SCL: U400.F7(PA26_/_PB05) ; port EDBG_DGI_TWI.SCL
EDBG_DGI_SDA: U400.G7(PA12_/_PA25) ; port EDBG_DGI_TWI.SDA
EDBG_FORCE_BOOT: TP401.1 U400.H9(PA20_/_PX18)
EDBG_JTAG_TCK: TP402.1 U400.K9(TCK)
EDBG_JTAG_TDI: TP403.1 U400.K8(TDI)
EDBG_JTAG_TDO: TP404.1 U400.J8(TDO)
EDBG_JTAG_TMS: TP405.1 U400.H7(TMS)
EDBG_RESET_N: TP406.1 U400.J9(RESET_N)
EDBG_SPI_DGI_MISO: R420.1 U400.K2(PX27)
EDBG_SPI_DGI_MOSI: U400.K3(PX28) ; port EDBG_DGI_SPI.MOSI
EDBG_SPI_DGI_SCK: U400.J4(PX29) ; port EDBG_DGI_SPI.SCK
EDBG_SPI_DGI_SS: U400.G5(PX30) ; port EDBG_DGI_SPI.SS
EDBG_USB_FS_N: R421.2 U400.B9(DMFS)
EDBG_USB_FS_P: R422.2 U400.B8(DPFS)
EDBG_USB_HS_N: D402.3(I/O_2) J400.2(D-) R421.1 U400.A9(DMHS)
EDBG_USB_HS_P: D402.2(I/O_1) J400.3(D+) R422.1 U400.A8(DPHS)
ID1: R409.1 U400.A1(PA28) ; port ID_SYS.ID_1
ID2: R402.1 U400.B2(PB01) ; port ID_SYS.ID_2
ID3: R401.1 U400.B3(PB02) ; port ID_SYS.ID_3
PA16_GPIO_IRQ: R417.1 ; port EDBG_DGI_GPIO.DGI_GPIO1
PA20_GPIO: R418.1 ; port EDBG_DGI_GPIO.DGI_GPIO2
PA21_GPIO: R419.1 ; port EDBG_DGI_GPIO.DGI_GPIO3
PA23_S3_UART_RX: R414.1 ; port EDBG_CDC_UART.RXD
PB01_ADC9: R416.1 ; port EDBG_DGI_GPIO.DGI_GPIO0
PB16_S5_SPI_MISO: R420.2 ; port EDBG_DGI_SPI.MISO
POWER_LED_CTRL: Q400.2(G2) R410.1 U400.K4(PX15_/_PX32)
Shield: C403.2 J400.6(SHIELD1) J400.7(SHIELD2) J400.8(SHIELD3) J400.9(SHIELD4) R424.2
STATUS_LED_CTRL: Q400.5(G1) R413.2 U400.F1(PX19__/_PX59)
SWDCLK: U400.D6(PB07) ; port EDBG_SWD.SWDCLK
SWDIO: U400.C5(PB09) ; port EDBG_SWD.SWDIO
TARGET_RESET: U400.B4(PA29) ; port EDBG_SWD.TARGET_RESET
TARGET_RESET_SENSE: U400.H2(PX21) ; port TARGET_RESET_SENSE  [project net TARGET_MCU_RESET]
XIN0: C400.1 U400.A5(PC02) XC400.1
XOUT0: C401.1 U400.A6(PC03) XC400.3
NetC402_1: C402.1 R423.2 U400.C7(USB_VBIAS)
NetC404_1: C404.1 L402.2 U400.J6(VDDANA)
NetC405_1: C405.1 C406.1 U400.E10(VDDCORE)
NetC407_1: C407.1 D402.4(VCC) J400.1(VBUS) L401.1
NetD400_1: D400.1(CATHODE) R411.2
NetD401_1: D401.1(CATHODE) R412.2
NetQ400_3: Q400.3(D1) R412.1
NetQ400_6: Q400.6(D2) R411.1

Not connected (* = marked no-connect by the designer): J400 4(ID)*; U400 A2(PA27)* A3(PB04)* A4(PA30)* A7(PC05)* B7(PC04)* C6(PB08)* D2(PX10)* D3(PX13)* D4(PX16_/_PX53)* D5(PB10)* D7(PB06)* E1(PA02_/_PX47)* E4(PX09)* E7(PA16)* E8(PA06_/_PA13)* G1(PX05)* G2(PX01)* G3(PX02)* G4(PX00)* G6(PA23_/_PX46)* G8(PA00_/_PA18)* G9(PA05)* G10(PA01_/_PA17)* H1(PX04)* H4(PX25)* H5(PX31)* H6(PA22_/_PX20)* H10(PA07_/_PA19)* J1(PX03)* J2(PX24)* J10(PA24_/_PX17)* K1(PX23)* K5(PC00_/_PX14)* K6(PC01)*; XC400 2* 4*

### Layout directives
differential pair; rule Assembly Testpoint Usage [Testpoint - Not Allowed    Multiple - Not Allowed]: EDBG_USB_FS_N, EDBG_USB_FS_P, EDBG_USB_HS_N, EDBG_USB_HS_P
rule Assembly Testpoint Usage [Testpoint - Not Allowed    Multiple - Not Allowed]: XIN0, XOUT0

### Notes on the sheet
- (near TP400) Connect the test points during startup of the EDBG to force it into bootloader mode.
  The test points should be covered with solder so that it is easier to get a good contact.
- (near R420) Current limiter, 10mA @3.3V
- Input filter on USB power input.
- Programming interface of the embedded debugger. The test points will be connected by needles in the test fixture for programming. GND test point is TP400.
- Date:
- PAGE:
- of
- TITLE:
- Document number:
- Revision:

### Library data of the parts
C400 C401 = A01-0019: Ceramic capacitor, SMD 0402, NP0, 50V, +/-5%; PartGroup: Capacitors,Ceramic,SMD 0402; TemperatureRange: -55 - +125 deg C; AN: A01-0019; Value: 22p; Tolerance: 50V, +/-5%; Height: 0,550000011920929
C402 = A01-0015: Ceramic capacitor, SMD 0402, NP0, 50V, +/-5%; PartGroup: Capacitors,Ceramic,SMD 0402; TemperatureRange: -55 - +125 deg C; AN: A01-0015; Value: 10p; Tolerance: 50V, +/-5%; Height: 0,550000011920929
C403 = A01-0046: Ceramic capacitor, SMD 0402, X7R, 25V, +/-10%; PartGroup: Capacitors,Ceramic,SMD 0402; TemperatureRange: -55 - +125 deg C; AN: A01-0046; Tolerance: 25V, +/-10%; Height: 0.550000011920929
C404 C410-C413 = A01-0246: as C304 on sheet SAML21_Xplained_Pro_Target_MCU; AN: A01-0246; Value: 100n; Tolerance: 16V, +/-10%; Height: 0,5
C405 C409 C414 C415 = A01-0300: Ceramic capacitor, SMD 0402, X5R, 6.3V, +/-20%; PartGroup: Capacitors,Ceramic,SMD 0402; Manufacturer: Kemet; MPN: C0402C225M9PAC; Tolerance: ±20%; TemperatureRange: -55°C to +85°C; AN: A01-0300; Height: 0,5
C406-C408 = A01-0321: Ceramic capacitor, SMD 0402, C0G, 50V, +/-5%; PartGroup: Capacitors,Ceramic,SMD 0402; Manufacturer: Murata; MPN: GRM1555C1H102JA01D; Tolerance: 5%; AN: A01-0321; Value: 1 nF C0G
D400 = A10-0018: LED, Green, Wave length=575nm, SMD 0805, ±70°; PartGroup: Opto,LEDs,SMD; Manufacturer: Everlight; TemperatureRange: -40 - +85 deg C; AN: A10-0018; Height: 1,10000002384186; MPN: EL17-21SYGC
D401 = A10-0019: LED, Yellow, Wave length=591nm, SMD 0805, ±70°; PartGroup: Opto,LEDs,SMD; Manufacturer: Everlight; MPN: 17-21UYC/S530-A3/TR8; TemperatureRange: -40 to +85 deg C; AN: A10-0019; Height: 1,10000002384186
D402 = A06-0236: Double rail-to-rail USB ESD protection diode; OrcadPartType: Integrated Circuits&Special function&Protection; Manufacturer: Philips; TemperatureRange: -40 to +85 C; AN: A06-0236; Value: PRTR5V0U2X; PartType: Buy; Height: 1,10000002384186; MPN: PRTR5V0U2X
J400 = A08-2112: Micro USB AB Connector, Standard SMT + DIP; PartGroup: Mechanical devices,Connectors,USB; AN: A08-2112; Height: 2.79999995231628
L401 L402 = A03-0035: as L301 on sheet SAML21_Xplained_Pro_Target_MCU; AN: A03-0035; Value: BLM18PG471SN1; Height: 0,800000011920929; MPN: BLM18PG471SN1
Q400 = A05-0051: Dual N-Channel MOSFET, 60V, 115mA cont,RDS(ON) < 7.5 Ohm @50mA@5V, SOT-363; PartGroup: Transistors,Small signal FET,SMD; Manufacturer: Fairchild; TemperatureRange: -65 to 150 deg C; AN: A05-0051; Height: 1,10000002384186; MPN: 2N7002DW
R401 R402 R409 = A02-0212: Thick film resistor, SMD 0402, 1/16W, 1%; PartGroup: Resistors,SMD,0402 1%; TemperatureRange: -55 - +125 deg C; AN: A02-0212; Tolerance: 1 %; Height: 0.349999994039536
R410 R413 R424 = A02-0284: Thick film resistor, SMD 0402, 1/16W, 1%; PartGroup: Resistors,SMD,0402 1%; Manufacturer: KOA; MPN: RK73H1ETTP1004F; TemperatureRange: -55 - +125 deg C; AN: A02-0284; Tolerance: 1 %
  R410 R413: Height: 0.349999994039536
  R424: Height: 0,349999994039536
R411 R412 R414 R416-R420 = A02-0200: Thick film resistor, SMD 0402, 1/16W, 1%; PartGroup: Resistors,SMD,0402 1%; TemperatureRange: -55 - +125 deg C; AN: A02-0200; Tolerance: 1 %
  R411 R412: Height: 0.349999994039536
  R414 R416-R420: Height: 0,349999994039536
R421 R422 = A02-0178: as R305 on sheet SAML21_Xplained_Pro_Target_MCU; AN: A02-0178; Tolerance: 1 %; Height: 0,349999994039536
R423 = A02-0539: Thick film resistor, SMD 0402, 1/16W, 1%; PartGroup: Resistors,SMD,0402 1%; TemperatureRange: -55 - +125 deg C; AN: A02-0539; Tolerance: 1%; Height: 0,349999994039536
TP400-TP407 = A08-0004: Single SMD testpad; PartGroup: Mechanical devices,Connectors,Test points; AN: A08-0004; Value: TESTPAD; Height: 0
U400 = A06-0736: AVR 32-bit RISC MCU; PartGroup: Integrated Circuits,MCU, MPU, DSP,AVR MCU; Manufacturer: ATMEL; TemperatureRange: -40 to +85 deg C; AN: A06-0736; Height: 1; MPN: AT32UC3A4256J-C1UR
XC400 = A07-0042: Fox FQ5032B 12.0MHz SMD crystal 738B-12; PartGroup: Frequency devices,Crystals,SMD; Manufacturer: Fox  Electronics; MPN: FQ5032B-12-C-C-C-200-1; Tolerance: 30PPM; AN: A07-0042; Value: 12.0MHz; Height: 1,20000004768372

## Sheet SAML21_Xplained_Pro_Connectors.SchDoc: Extension connectors
size A3; Organization: ATMEL Norway; Address1: Vestre Rosten 79; Address2: N-7075 TILLER; Address3: NORWAY; DocumentNumber: A09-2241; Revision: 4; SheetNumber: 4; SheetTotal: 10; PageSetup: Record=PageOptions|CenterHorizontal=True|CenterVertical=True|PrintScale=1.01|XCorrection=1.00|YCorrection=1.00|PrintKind=1|BorderSize=5000000|LeftOffset=0|BottomOffset=0|Orientation=2|PaperLength=1000|PaperWidth=1000|Scale=100|PaperSource=7|PrintQuality=-4|MediaType=1|DitherType=10|PaperKind=A3 (297 x 420 mm)|PrintScaleMode=1
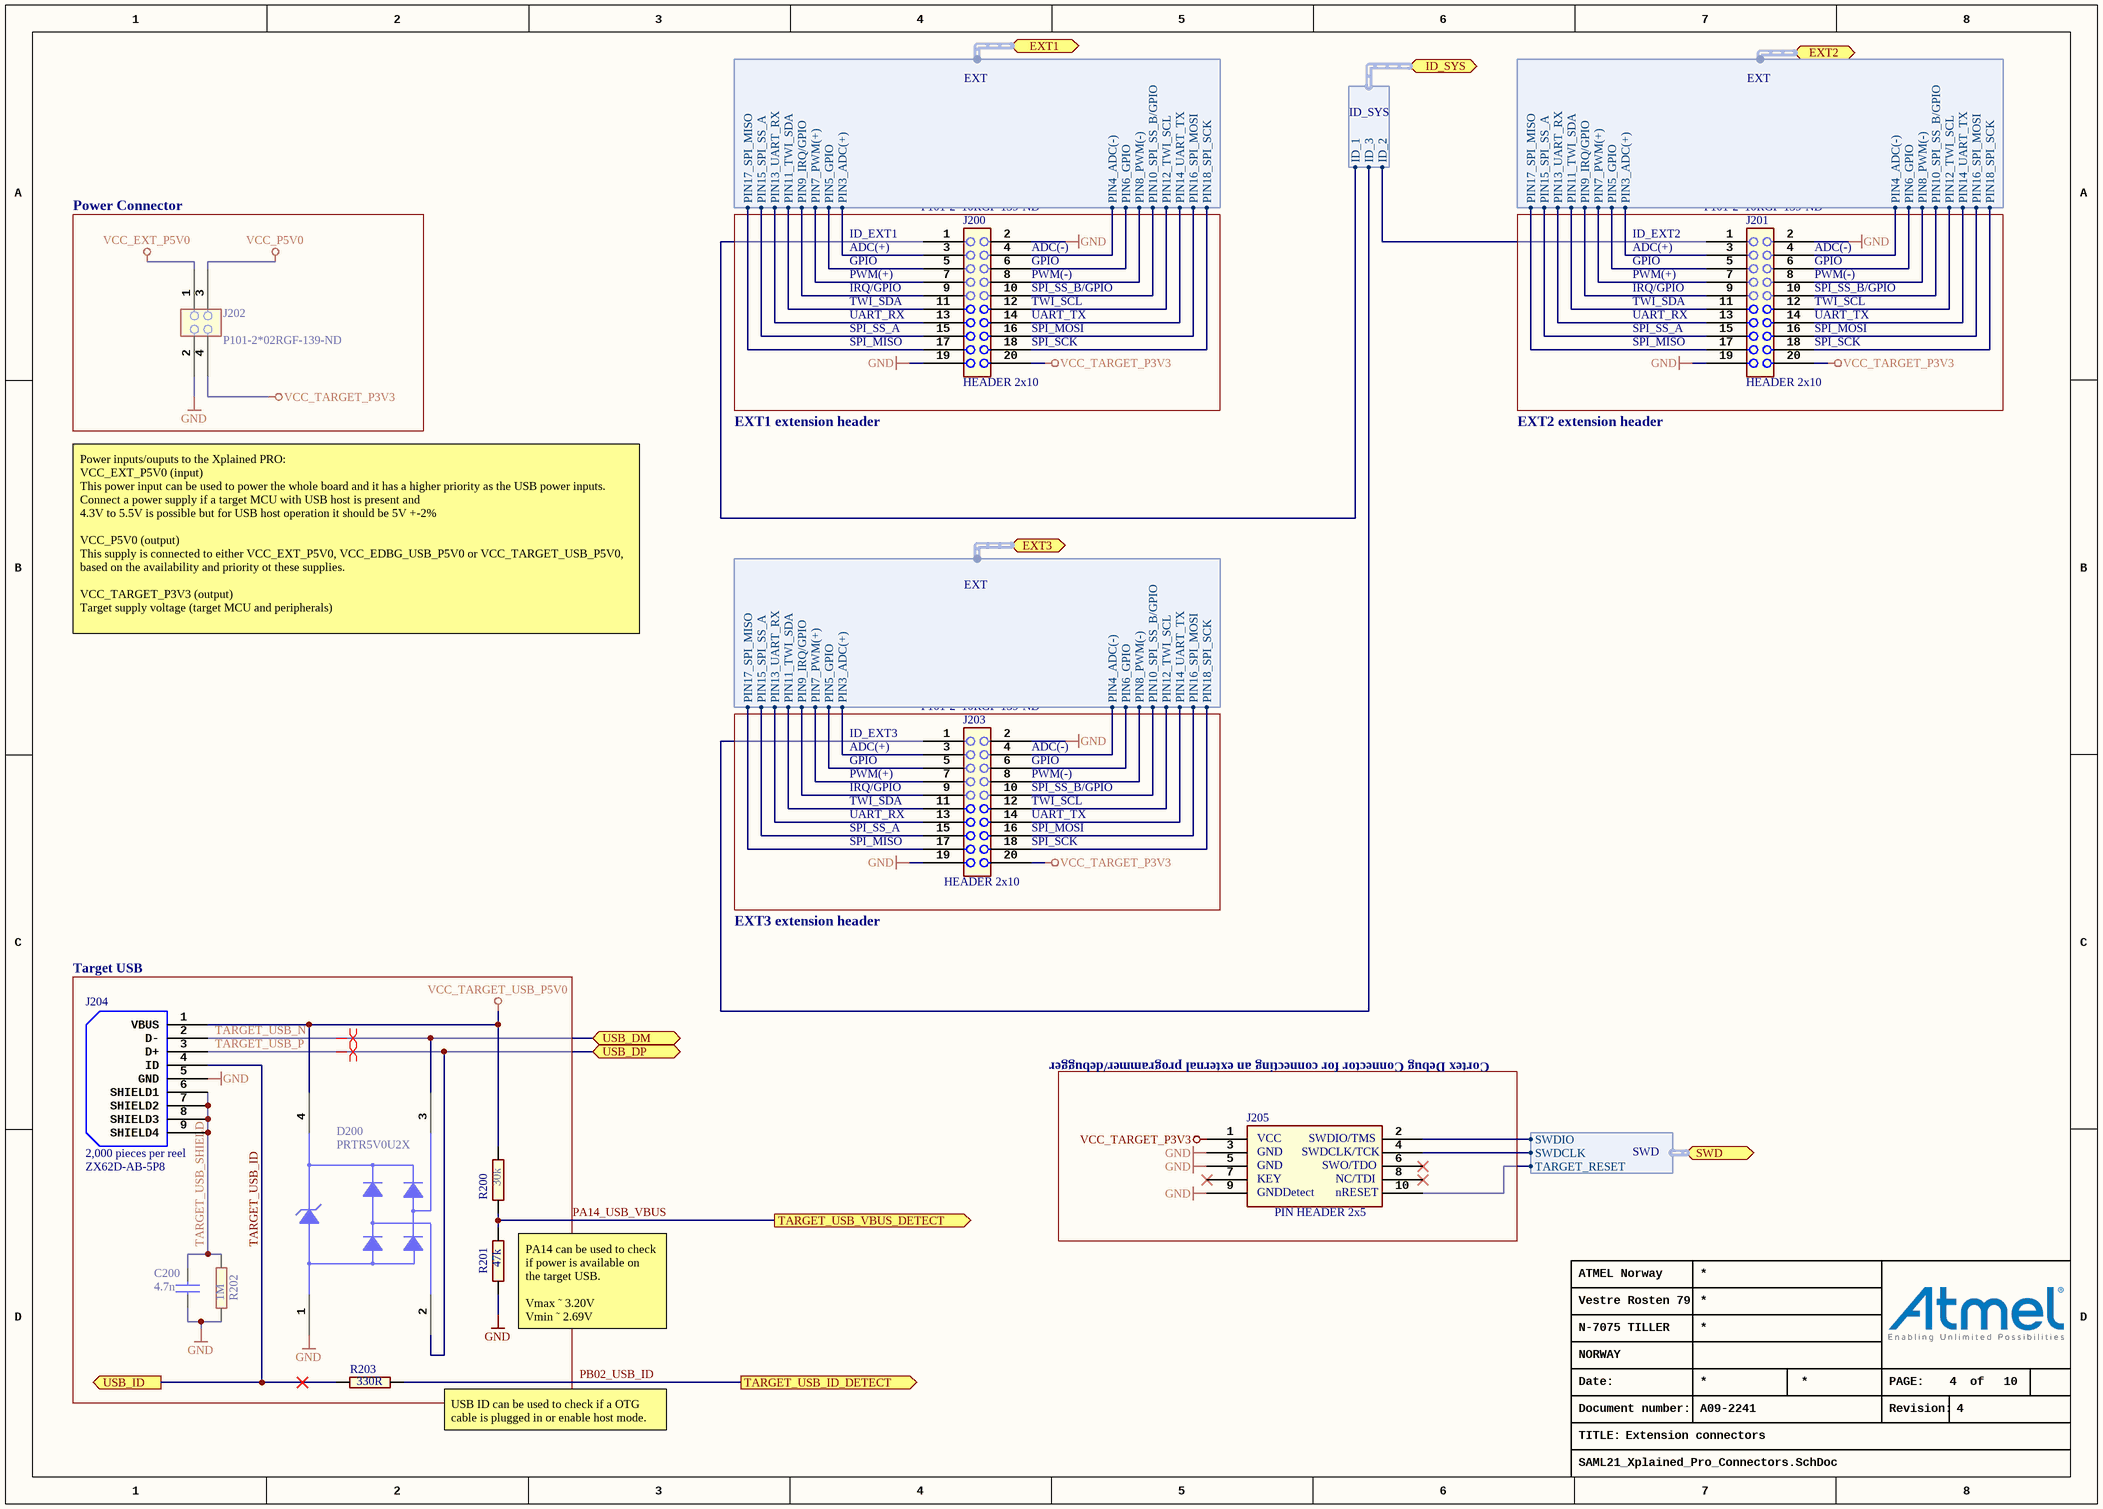
[diagram p3: SAML21_Xplained_Pro_Connectors.SchDoc]

### Parts
C200  value 4.7n  [AP1-00053]  (hidden comment: CAP-NONPOL)
D200  PRTR5V0U2X  [AP4-00001]
J200  HEADER 2x10  value P101-2*10RGF-139-ND  [AP8-00622]
J201  HEADER 2x10  value P101-2*10RGF-139-ND  [AP8-00622]
J202  value P101-2*02RGF-139-ND  [AP8-00628]  (hidden comment: HEADER 2x2)
J203  HEADER 2x10  value P101-2*10RGF-139-ND  [AP8-00622]
J204  2,000 pieces per reel  value ZX62D-AB-5P8  [AP8-00852]
J205  value PIN HEADER 2x5  [AP8-00257]  (hidden comment: HEADER 2x5)
R200  value 30k  [AP2-00011]  (hidden comment: R2)
R201  value 47k  [AP2-00011]  (hidden comment: R2)
R202  value 1M  [AP2-00011]  (hidden comment: R2)
R203  value 330R  [AP2-00011]  (hidden comment: R2)

### Blocks framed on the sheet
Power Connector: J202
Target USB: C200 D200 J204 R200-R203

### Ports
EXT1 (harness EXT), EXT2 (harness EXT), EXT3 (harness EXT), ID_SYS (harness ID_SYS), SWD (harness SWD), TARGET_USB_ID_DETECT (out), TARGET_USB_VBUS_DETECT (out), USB_DM (bidir), USB_DP (bidir), USB_ID (out)

### Harnesses
ID_SYS: ID_1, ID_2, ID_3
EXT: PIN3_ADC(+), PIN4_ADC(-), PIN5_GPIO, PIN6_GPIO, PIN7_PWM(+), PIN8_PWM(-), PIN9_IRQ/GPIO, PIN10_SPI_SS_B/GPIO, PIN11_TWI_SDA, PIN12_TWI_SCL, PIN13_UART_RX, PIN14_UART_TX, PIN15_SPI_SS_A, PIN16_SPI_MOSI, PIN17_SPI_MISO, PIN18_SPI_SCK
SWD: SWDCLK, SWDIO, TARGET_RESET

### Nets
GND: C200.1 D200.1(GND) J200.2 J200.19 J201.2 J201.19 J202.2 J203.2 J203.19 J204.5(GND) J205.3 J205.5 J205.9 R201.1 R202.1
VCC_EXT_P5V0: J202.1
VCC_P5V0: J202.3
VCC_TARGET_P3V3: J200.20 J201.20 J202.4 J203.20 J205.1
VCC_TARGET_USB_P5V0: D200.4(VCC) J204.1(VBUS) R200.2
EDBG_DGI_SCL: J200.12 J201.12 J203.12 ; port EXT1.PIN12_TWI_SCL, port EXT3.PIN12_TWI_SCL, port EXT2.PIN12_TWI_SCL
EDBG_DGI_SDA: J200.11 J201.11 J203.11 ; port EXT1.PIN11_TWI_SDA, port EXT3.PIN11_TWI_SDA, port EXT2.PIN11_TWI_SDA
EDBG_SPI_DGI_MOSI: J201.16 J203.16 ; port EXT3.PIN16_SPI_MOSI, port EXT2.PIN16_SPI_MOSI
EDBG_SPI_DGI_SCK: J201.18 J203.18 ; port EXT3.PIN18_SPI_SCK, port EXT2.PIN18_SPI_SCK
ID1: J200.1 ; port ID_SYS.ID_1
ID2: J201.1 ; port ID_SYS.ID_2
ID3: J203.1 ; port ID_SYS.ID_3
PA02_GPIO_SS_BTN: J200.10 ; port EXT1.PIN10_SPI_SS_B/GPIO
PA03_ADC1: J200.4 ; port EXT1.PIN4_ADC(-)
PA04_S0_SPI_MISO: J200.17 ; port EXT1.PIN17_SPI_MISO
PA05_S0_SPI_SS: J200.15 ; port EXT1.PIN15_SPI_SS_A
PA06_S0_SPI_MOSI: J200.16 ; port EXT1.PIN16_SPI_MOSI
PA07_S0_SPI_SCK: J200.18 ; port EXT1.PIN18_SPI_SCK
PA10_ADC18_PTCY8: J201.3 ; port EXT2.PIN3_ADC(+)
PA11_ADC19: J201.4 ; port EXT2.PIN4_ADC(-)
PA12_PWM_TCC2_0: J200.7 ; port EXT1.PIN7_PWM(+)
PA13_PWM_TCC2_1: J200.8 ; port EXT1.PIN8_PWM(-)
PA14_USB_VBUS: R200.1 R201.2 ; port TARGET_USB_VBUS_DETECT
PA15_GPIO: J203.6 ; port EXT3.PIN6_GPIO
PA16_GPIO_IRQ: J203.9 ; port EXT3.PIN9_IRQ/GPIO
PA17_GPIO: J201.15 ; port EXT2.PIN15_SPI_SS_A
PA18_S1_UART_TX: J201.14 J203.14 ; port EXT3.PIN14_UART_TX, port EXT2.PIN14_UART_TX
PA19_S1_UART_RX: J201.13 J203.13 ; port EXT3.PIN13_UART_RX, port EXT2.PIN13_UART_RX
PA20_GPIO: J201.5 ; port EXT2.PIN5_GPIO
PA21_GPIO: J201.6 ; port EXT2.PIN6_GPIO
PA27_GPIO_SS: J203.10 ; port EXT3.PIN10_SPI_SS_B/GPIO
PB00_ADC8: J203.3 ; port EXT3.PIN3_ADC(+)
PB01_ADC9: J203.4 ; port EXT3.PIN4_ADC(-)
PB02_USB_ID: R203.2 ; port TARGET_USB_ID_DETECT
PB04_GPIO_IRQ4: J200.9 ; port EXT1.PIN9_IRQ/GPIO
PB05_ADC13: J200.3 ; port EXT1.PIN3_ADC(+)
PB06_GPIO: J200.5 ; port EXT1.PIN5_GPIO
PB07_GPIO: J200.6 ; port EXT1.PIN6_GPIO
PB08_S4_UART_TX: J200.14 ; port EXT1.PIN14_UART_TX
PB09_S4_UART_RX: J200.13 ; port EXT1.PIN13_UART_RX
PB10_PWM_TCC0_4: J203.7 ; port EXT3.PIN7_PWM(+)
PB11_PWM_TCC0_5: J203.8 ; port EXT3.PIN8_PWM(-)
PB12_PWM_TC4_0: J201.7 ; port EXT2.PIN7_PWM(+)
PB13_PWM_TC4_1: J201.8 ; port EXT2.PIN8_PWM(-)
PB14_GPIO_IRQ14: J201.9 ; port EXT2.PIN9_IRQ/GPIO
PB15_GPIO_SS: J201.10 ; port EXT2.PIN10_SPI_SS_B/GPIO
PB16_S5_SPI_MISO: J201.17 J203.17 ; port EXT3.PIN17_SPI_MISO, port EXT2.PIN17_SPI_MISO
PB17_S5_SPI_SS: J203.15 ; port EXT3.PIN15_SPI_SS_A
PB30_GPIO: J203.5 ; port EXT3.PIN5_GPIO
SWDCLK: J205.4 ; port SWD.SWDCLK
SWDIO: J205.2 ; port SWD.SWDIO
TARGET_RESET: J205.10 ; port SWD.TARGET_RESET
TARGET_USB_ID: J204.4(ID) R203.1 ; port USB_ID
TARGET_USB_N: D200.3(I/O_2) J204.2(D-) ; port USB_DM
TARGET_USB_P: D200.2(I/O_1) J204.3(D+) ; port USB_DP
TARGET_USB_SHIELD: C200.2 J204.6(SHIELD1) J204.7(SHIELD2) J204.8(SHIELD3) J204.9(SHIELD4) R202.2

Not connected (* = marked no-connect by the designer): J205 6* 7* 8*

### Layout directives
differential pair; rule Assembly Testpoint Usage [Testpoint - Not Allowed    Multiple - Not Allowed]: TARGET_USB_N, TARGET_USB_P

### Notes on the sheet
- ID_EXT1
- ID_EXT2
- ADC(+)
- GPIO
- PWM(+)
- IRQ/GPIO
- TWI_SDA
- UART_RX
- (near J200) ADC(-)
- (near J200) GPIO
- (near J200) PWM(-)
- (near J200) SPI_SS_B/GPIO
- (near J200) TWI_SCL
- (near J200) UART_TX
- (near J201) ADC(-)
- (near J201) GPIO
- (near J201) PWM(-)
- (near J201) SPI_SS_B/GPIO
- (near J201) TWI_SCL
- (near J201) UART_TX
- SPI_SS_A
- SPI_MISO
- (near J200) SPI_MOSI
- (near J200) SPI_SCK
- (near J201) SPI_MOSI
- (near J201) SPI_SCK
- EXT1 extension header
- EXT2 extension header
- Power inputs/ouputs to the Xplained PRO:
  VCC_EXT_P5V0 (input)
  This power input can be used to power the whole board and it has a higher priority as the USB power inputs. Connect a power supply if a target MCU with USB host is present and
  4.3V to 5.5V is possible but for USB host operation it should be 5V +-2%
  VCC_P5V0 (output)
  This supply is connected to either VCC_EXT_P5V0, VCC_EDBG_USB_P5V0 or VCC_TARGET_USB_P5V0, based on the availability and priority ot these supplies.
  VCC_TARGET_P3V3 (output)
  Target supply voltage (target MCU and peripherals)
- ID_EXT3
- (near J203) ADC(-)
- (near J203) GPIO
- (near J203) PWM(-)
- (near J203) SPI_SS_B/GPIO
- (near J203) TWI_SCL
- (near J203) UART_TX
- (near J203) SPI_MOSI
- (near J203) SPI_SCK
- EXT3 extension header
- Cortex Debug Connector for connecting an external programmer/debugger
- (near R201) PA14 can be used to check
  if power is available on
  the target USB.
  Vmax ˜ 3.20V
  Vmin ˜ 2.69V
- USB ID can be used to check if a OTG cable is plugged in or enable host mode.
- Date:
- PAGE:
- of
- TITLE:
- Document number:
- Revision:
- (in symbol A08-0385) VCC; SWDIO/TMS; GND; SWDCLK/TCK; SWO/TDO; KEY; NC/TDI; GNDDetect; nRESET

### Library data of the parts
C200 = A01-0046: as C403 on sheet SAML21_Xplained_Pro_EDBG; AN: A01-0046; Tolerance: 25V, +/-10%; Height: 0.550000011920929
D200 = A06-0236: as D402 on sheet SAML21_Xplained_Pro_EDBG; AN: A06-0236; Value: PRTR5V0U2X; PartType: Buy; Height: 1,10000002384186; MPN: PRTR5V0U2X
J200 J201 J203 = A08-1513: Pin header, 2x10, Right Angle, 2.54mm, THM, Pin In Paste; PartGroup: Mechanical devices,Connectors,Pin headers; AN: A08-1513; MPN: P101-2*10RGF-139-ND
J202 = A08-1519: Pin header, 2x2, Right Angle, 2.54mm, THT, Pin In Paste; PartGroup: Mechanical devices,Connectors,Pin headers; AN: A08-1519; Height: 5.07999992370605; MPN: P101-2*02RGF-139-ND
J204 = A08-2112: as J400 on sheet SAML21_Xplained_Pro_EDBG; AN: A08-2112; Height: 2.79999995231628
J205 = A08-0385: 2x5 pin header, 1.27mm pitch, THM; PartGroup: Mechanical devices,Connectors,Pin headers; Manufacturer: Garry; MPN: STL21-0730 G TT-10U; AN: A08-0385; Height: 7,30000019073486
R200 = A02-0247: Thick film resistor, SMD 0402, 1/16W, 1%; PartGroup: Resistors,SMD,0402 1%; TemperatureRange: -55 - +125 deg C; AN: A02-0247; Tolerance: 1 %; Height: 0.349999994039536
R201 = A02-0252: Thick film resistor, SMD 0402, 1/16W, 1%; PartGroup: Resistors,SMD,0402 1%; TemperatureRange: -55 - +125 deg C; AN: A02-0252; Tolerance: 1 %; Height: 0.349999994039536
R202 = A02-0284: as R410 on sheet SAML21_Xplained_Pro_EDBG; AN: A02-0284; Tolerance: 1 %; Height: 0,349999994039536
R203 = A02-0200: as R411 on sheet SAML21_Xplained_Pro_EDBG; AN: A02-0200; Tolerance: 1 %; Height: 0.349999994039536